# Altium schematic sheet Sheet1.SchDoc
size A4; SheetNumber: 1; SheetTotal: 1
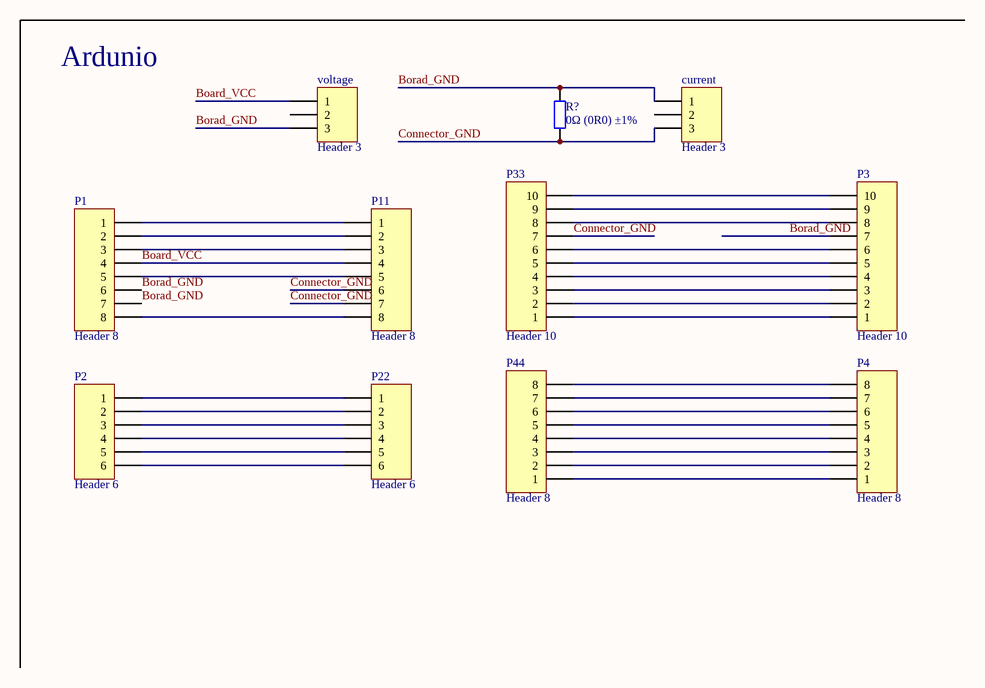
[diagram p0: Sheet1.SchDoc]

## Parts
current  Header 3  [HDR1X3]
P1  Header 8  [HDR1X8]
P2  Header 6  [HDR1X6]
P3  Header 10  [HDR1X10]
P4  Header 8  [HDR1X8]
P11  Header 8  [HDR1X8]
P22  Header 6  [HDR1X6]
P33  Header 10  [HDR1X10]
P44  Header 8  [HDR1X8]
R?  0Ω (0R0) ±1%  [0805_R]
voltage  Header 3  [HDR1X3]

## Nets
Board_VCC: P1.4 P11.4 voltage.1
Borad_GND: current.1 P1.6 P1.7 P3.7 R?.2 voltage.3
Connector_GND: current.3 P11.6 P11.7 P33.7 R?.1
NetP1_1: P1.1 P11.1
NetP1_2: P1.2 P11.2
NetP1_3: P1.3 P11.3
NetP1_5: P1.5 P11.5
NetP1_8: P1.8 P11.8
NetP2_1: P2.1 P22.1
NetP2_2: P2.2 P22.2
NetP2_3: P2.3 P22.3
NetP2_4: P2.4 P22.4
NetP2_5: P2.5 P22.5
NetP2_6: P2.6 P22.6
NetP3_1: P3.1 P33.1
NetP3_2: P3.2 P33.2
NetP3_3: P3.3 P33.3
NetP3_4: P3.4 P33.4
NetP3_5: P3.5 P33.5
NetP3_6: P3.6 P33.6
NetP3_8: P3.8 P33.8
NetP3_9: P3.9 P33.9
NetP3_10: P3.10 P33.10
NetP4_1: P4.1 P44.1
NetP4_2: P4.2 P44.2
NetP4_3: P4.3 P44.3
NetP4_4: P4.4 P44.4
NetP4_5: P4.5 P44.5
NetP4_6: P4.6 P44.6
NetP4_7: P4.7 P44.7
NetP4_8: P4.8 P44.8

Not connected (* = marked no-connect by the designer): current 2; voltage 2

## Notes on the sheet
- Ardunio
- Labels drawn without touching a wire or pin: \

## Library data of the parts
current voltage = Header 3: Header, 3-Pin; LatestRevisionDate: 17-Jul-2002; LatestRevisionNote: Re-released for DXP Platform.; Publisher: Altium Limited
P1 P4 P11 P44 = Header 8: Header, 8-Pin; LatestRevisionDate: 17-Jul-2002; LatestRevisionNote: Re-released for DXP Platform.; Publisher: Altium Limited
P2 P22 = Header 6: Header, 6-Pin; LatestRevisionDate: 17-Jul-2002; LatestRevisionNote: Re-released for DXP Platform.; Publisher: Altium Limited
P3 P33 = Header 10: Header, 10-Pin; LatestRevisionDate: 17-Jul-2002; LatestRevisionNote: Re-released for DXP Platform.; Publisher: Altium Limited
R? = 0805 0Ω (0R0) 1%: 贴片电阻; ComponentLink1Description: 供应商链接; ComponentLink1URL: http://www.szlcsc.com/product/details_18165.html; Package: 0805; Supplier: LC; SuppliersPartNumber: C17477